# Altium project SC_Flight_Controller.PrjPcb
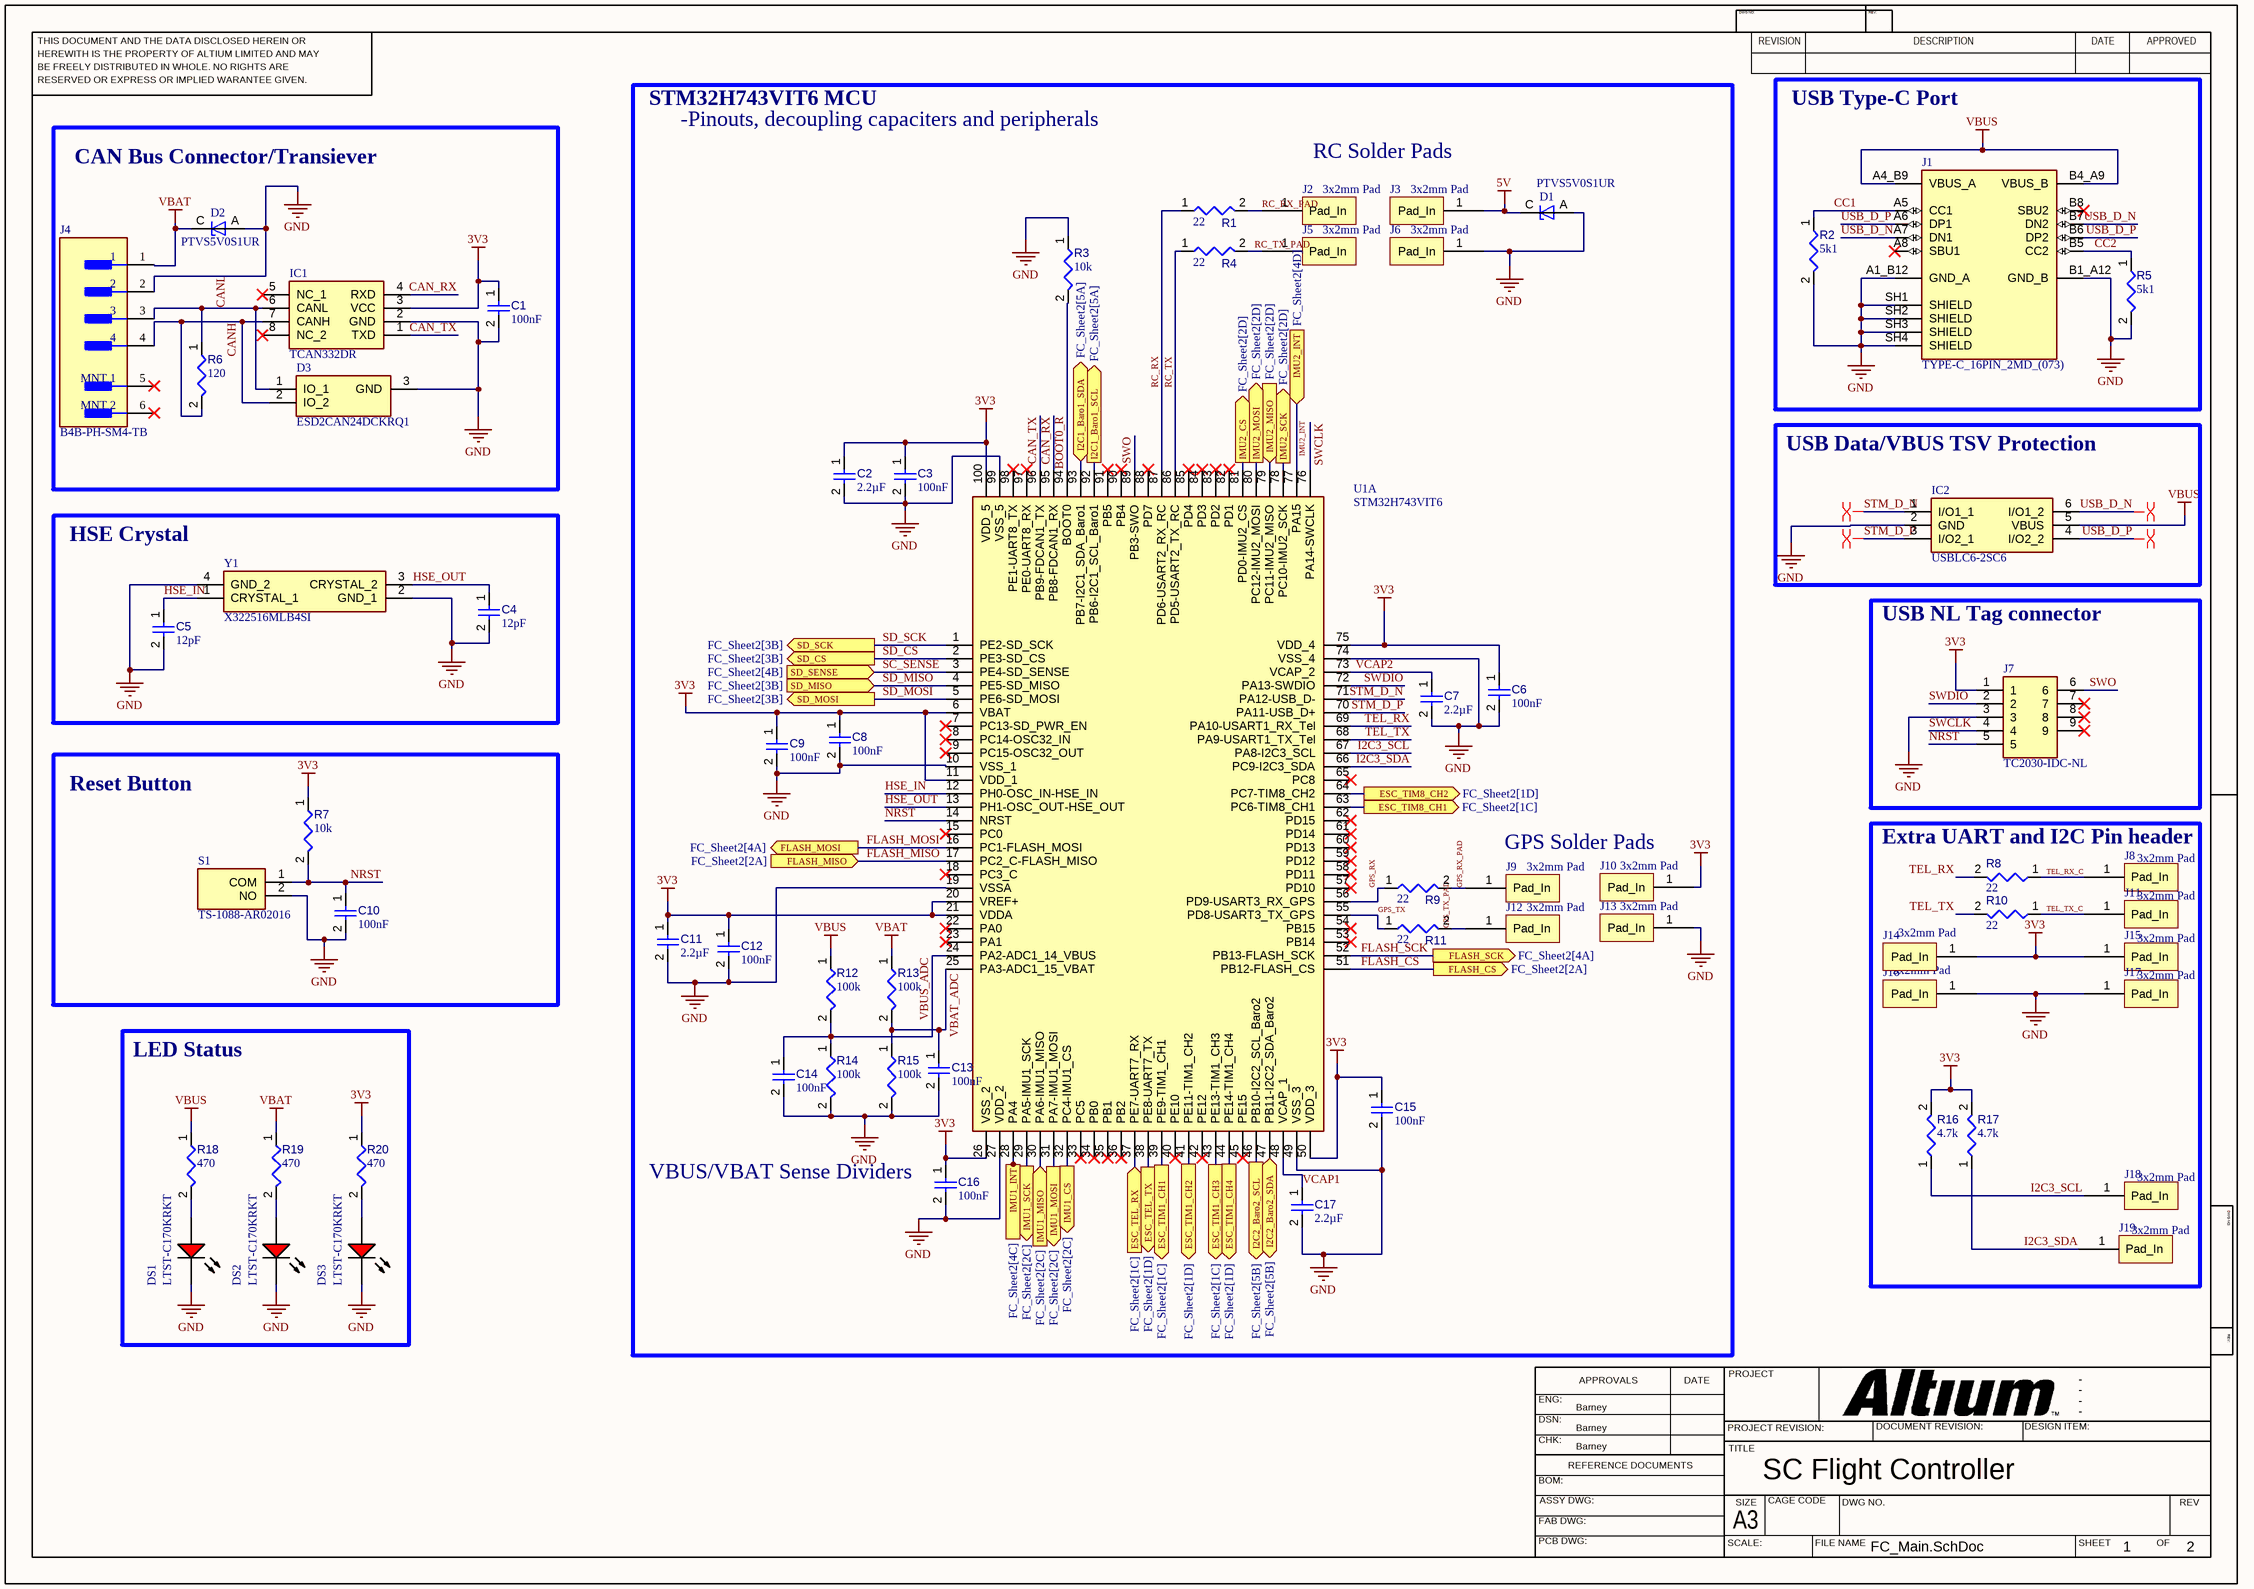
[diagram p0: FC_Main.SchDoc]
2 sheets, 137 parts. Net scope: flat (ports and power ports of the same name join across sheets).
Board file: FC_PCB.PcbDoc
Sheets:
  FC_Main.SchDoc
  FC_Sheet2.SchDoc

## Sheet FC_Main.SchDoc: SC Flight Controller
size 420 x 297 mm; Date: 07/02/2026; ApprovedBy: Barney; CheckedBy: Barney; Author: Barney; CompanyName: -; DrawnBy: Barney; Engineer: Barney; Organization: N/A; Address1: -; Address2: -; Address3: -; Address4: -; DocumentNumber: 1; Revision: 1; SheetNumber: 1; SheetTotal: 2; Time: 12:42

### Parts
C1  value 100nF  [CAPC0402(1005)60_L]  (hidden comment: Capacitor 100nF +/-20% 10V 0402)
C2  value 2.2µF  [CAPC0402(1005)60_L]  (hidden comment: Capacitor 2,2µF +/-20% 10V 0402)
C3  value 100nF  [CAPC0402(1005)60_L]  (hidden comment: Capacitor 100nF +/-20% 10V 0402)
C4  value 12pF  [CAPC0402(1005)33_L]  (hidden comment: Capacitor 12pF +/-10% 50V 0402)
C5  value 12pF  [CAPC0402(1005)33_L]  (hidden comment: Capacitor 12pF +/-10% 50V 0402)
C6  value 100nF  [CAPC0402(1005)60_L]  (hidden comment: Capacitor 100nF +/-20% 10V 0402)
C7  value 2.2µF  [CAPC0402(1005)60_L]  (hidden comment: Capacitor 2,2µF +/-20% 10V 0402)
C8  value 100nF  [CAPC0402(1005)60_L]  (hidden comment: Capacitor 100nF +/-20% 10V 0402)
C9  value 100nF  [CAPC0402(1005)60_L]  (hidden comment: Capacitor 100nF +/-20% 10V 0402)
C10  value 100nF  [CAPC0402(1005)60_L]  (hidden comment: Capacitor 100nF +/-20% 10V 0402)
C11  value 2.2µF  [CAPC0402(1005)60_L]  (hidden comment: Capacitor 2,2µF +/-20% 10V 0402)
C12  value 100nF  [CAPC0402(1005)60_L]  (hidden comment: Capacitor 100nF +/-20% 10V 0402)
C13  value 100nF  [CAPC0402(1005)60_L]  (hidden comment: Capacitor 100nF +/-20% 10V 0402)
C14  value 100nF  [CAPC0402(1005)60_L]  (hidden comment: Capacitor 100nF +/-20% 10V 0402)
C15  value 100nF  [CAPC0402(1005)60_L]  (hidden comment: Capacitor 100nF +/-20% 10V 0402)
C16  value 100nF  [CAPC0402(1005)60_L]  (hidden comment: Capacitor 100nF +/-20% 10V 0402)
C17  value 2.2µF  [CAPC0402(1005)60_L]  (hidden comment: Capacitor 2,2µF +/-20% 10V 0402)
D1  PTVS5V0S1UR  [TVS_PTVS5V0S1UR]
D2  PTVS5V0S1UR  [TVS_PTVS5V0S1UR]
D3  ESD2CAN24DCKRQ1  [SOT65P210X110-3N]
DS1  LTST-C170KRKT  [LTST-C170KRKT_V]
DS2  LTST-C170KRKT  [LTST-C170KRKT_V]
DS3  LTST-C170KRKT  [LTST-C170KRKT_V]
IC1  TCAN332DR  [SOIC127P600X175-8N]
IC2  USBLC6-2SC6  [SOT95P280X145-6N]
J1  TYPE-C_16PIN_2MD_(073)  [SHOUHAN_TYPE-C_16PIN_2MD_(073)]
J2  3x2mm Pad  [3x2mm Pad-Footprint-1]
J3  3x2mm Pad  [3x2mm Pad-Footprint-1]
J4  B4B-PH-SM4-TB  [FP-B4B-PH-SM4-TB-MFG]
J5  3x2mm Pad  [3x2mm Pad-Footprint-1]
J6  3x2mm Pad  [3x2mm Pad-Footprint-1]
J7  TC2030-IDC-NL  [TC2030IDCNL]
J8  3x2mm Pad  [3x2mm Pad-Footprint-1]
J9  3x2mm Pad  [3x2mm Pad-Footprint-1]
J10  3x2mm Pad  [3x2mm Pad-Footprint-1]
J11  3x2mm Pad  [3x2mm Pad-Footprint-1]
J12  3x2mm Pad  [3x2mm Pad-Footprint-1]
J13  3x2mm Pad  [3x2mm Pad-Footprint-1]
J14  3x2mm Pad  [3x2mm Pad-Footprint-1]
J15  3x2mm Pad  [3x2mm Pad-Footprint-1]
J16  3x2mm Pad  [3x2mm Pad-Footprint-1]
J17  3x2mm Pad  [3x2mm Pad-Footprint-1]
J18  3x2mm Pad  [3x2mm Pad-Footprint-1]
J19  3x2mm Pad  [3x2mm Pad-Footprint-1]
R1  value 22  [RESC0402(1005)_L]  (hidden comment: Resistor 22 +/-1 % 0402 63 mW)
R2  value 5k1  [RESC0402(1005)_L]  (hidden comment: Resistor 5K1 +/-1 % 0402 63 mW)
R3  value 10k  [RESC0402(1005)_L]  (hidden comment: Resistor 10K  +/-1 % 0402 63 mW)
R4  value 22  [RESC0402(1005)_L]  (hidden comment: Resistor 22 +/-1 % 0402 63 mW)
R5  value 5k1  [RESC0402(1005)_L]  (hidden comment: Resistor 5K1 +/-1 % 0402 63 mW)
R6  value 120  [RESC0402(1005)_L]  (hidden comment: Resistor 120 +/-1 % 0402 63 mW)
R7  value 10k  [RESC0402(1005)_L]  (hidden comment: Resistor 10K  +/-1 % 0402 63 mW)
R8  value 22  [RESC0402(1005)_L]  (hidden comment: Resistor 22 +/-1 % 0402 63 mW)
R9  value 22  [RESC0402(1005)_L]  (hidden comment: Resistor 22 +/-1 % 0402 63 mW)
R10  value 22  [RESC0402(1005)_L]  (hidden comment: Resistor 22 +/-1 % 0402 63 mW)
R11  value 22  [RESC0402(1005)_L]  (hidden comment: Resistor 22 +/-1 % 0402 63 mW)
R12  value 100k  [RESC0402(1005)_L]  (hidden comment: Resistor 100K +/-1 % 0402 63 mW)
R13  value 100k  [RESC0402(1005)_L]  (hidden comment: Resistor 100K +/-1 % 0402 63 mW)
R14  value 100k  [RESC0402(1005)_L]  (hidden comment: Resistor 100K +/-1 % 0402 63 mW)
R15  value 100k  [RESC0402(1005)_L]  (hidden comment: Resistor 100K +/-1 % 0402 63 mW)
R16  value 4.7k  [RESC0402(1005)_L]  (hidden comment: 4D7KR2F)
R17  value 4.7k  [RESC0402(1005)_L]  (hidden comment: 4D7KR2F)
R18  value 470  [RESC0805(2012)_L]  (hidden comment: Resistor 470R +/-5% 0805 125 mW)
R19  value 470  [RESC0805(2012)_L]  (hidden comment: Resistor 470R +/-5% 0805 125 mW)
R20  value 470  [RESC0805(2012)_L]  (hidden comment: Resistor 470R +/-5% 0805 125 mW)
S1  TS-1088-AR02016  [TS1088AR02016]
U1  STM32H743VIT6  [QFP50P1600X1600X160-100N]  (part A of 3)
Y1  X322516MLB4SI  [X322516MLB4SI]

### Blocks framed on the sheet
USB Type-C Port: J1 R2 R5
CAN Bus Connector/Transiever: C1 D2 D3 IC1 J4 R6
USB Data/VBUS TSV Protection: IC2
HSE Crystal: C4 C5 Y1
USB NL Tag connector: J7
Reset Button: C10 R7 S1
Extra UART and I2C Pin header: J8 J11 J14-J19 R8 R10 R16 R17
LED Status: DS1-DS3 R18-R20

### Ports
ESC_TEL_RX (in, see FC_Sheet2[1C]), ESC_TEL_TX (out, see FC_Sheet2[1D]), ESC_TIM1_CH1 (out, see FC_Sheet2[1C]), ESC_TIM1_CH2 (out, see FC_Sheet2[1D]), ESC_TIM1_CH3 (out, see FC_Sheet2[1C]), ESC_TIM1_CH4 (out, see FC_Sheet2[1D]), ESC_TIM8_CH1 (out, see FC_Sheet2[1C]), ESC_TIM8_CH2 (out, see FC_Sheet2[1D]), FLASH_CS (out, see FC_Sheet2[2A]), FLASH_MISO (in, see FC_Sheet2[2A]), FLASH_MOSI (out, see FC_Sheet2[4A]), FLASH_SCK (out, see FC_Sheet2[4A]), I2C1_Baro1_SCL (out, see FC_Sheet2[5A]), I2C1_Baro1_SDA (bidir, see FC_Sheet2[5A]), I2C2_Baro2_SCL (out, see FC_Sheet2[5B]), I2C2_Baro2_SDA (bidir, see FC_Sheet2[5B]), IMU1_CS (out, see FC_Sheet2[2C]), IMU1_INT (in, see FC_Sheet2[4C]), IMU1_MISO (in, see FC_Sheet2[2C]), IMU1_MOSI (out, see FC_Sheet2[2C]), IMU1_SCK (out, see FC_Sheet2[2C]), IMU2_CS (out, see FC_Sheet2[2D]), IMU2_INT (in, see FC_Sheet2[4D]), IMU2_MISO (in, see FC_Sheet2[2D]), IMU2_MOSI (out, see FC_Sheet2[2D]), IMU2_SCK (out, see FC_Sheet2[2D]), SD_CS (out, see FC_Sheet2[3B]), SD_MISO (in, see FC_Sheet2[3B]), SD_MOSI (out, see FC_Sheet2[3B]), SD_SCK (out, see FC_Sheet2[3B]), SD_SENSE (in, see FC_Sheet2[4B])

### Nets
3V3: C1.1 C2.1 C3.1 C6.1 C8.1 C9.1 C11.1 C12.1 C15.1 C16.1 IC1.3(VCC) J7.1 J10.1(Pad_In) J14.1(Pad_In) J15.1(Pad_In) R7.1 R16.2 R17.2 R20.1 U1.6(VBAT) U1.11(VDD_1) U1.20(VREF+) U1.21(VDDA) U1.26(VSS_2) U1.50(VDD_3) U1.75(VDD_4) U1.100(VDD_5)
5V: D1.C J3.1(Pad_In)
GND: C1.2 C2.2 C3.2 C4.2 C5.2 C6.2 C7.2 C8.2 C9.2 C10.2 C11.2 C12.2 C13.2 C14.2 C15.2 C16.2 C17.2 D1.A D2.A D3.3(GND) DS1.2(K) DS2.2(K) DS3.2(K) IC1.2(GND) IC2.2(GND) J1.A1_B12(GND_A) J1.B1_A12(GND_B) J1.SH1(SHIELD) J1.SH2(SHIELD) J1.SH3(SHIELD) J1.SH4(SHIELD) J4.2 J6.1(Pad_In) J7.3 J13.1(Pad_In) J16.1(Pad_In) J17.1(Pad_In) R2.2 R3.1 R5.2 R14.2 R15.2 S1.2(NO) U1.10(VSS_1) U1.19(VSSA) U1.27(VDD_2) U1.49(VSS_3) U1.74(VSS_4) U1.99(VSS_5) Y1.2(GND_1) Y1.4(GND_2)
VBAT: D2.C J4.1 R13.1 R19.1
VBUS: IC2.5(VBUS) J1.A4_B9(VBUS_A) J1.B4_A9(VBUS_B) R12.1 R18.1
Baro1_SCL: U1.92(PB6-I2C1_SCL_Baro1) ; port I2C1_Baro1_SCL
Baro1_SDA: U1.93(PB7-I2C1_SDA_Baro1) ; port I2C1_Baro1_SDA
Baro2_SCL: U1.46(PB10-I2C2_SCL_Baro2) ; port I2C2_Baro2_SCL
Baro2_SDA: U1.47(PB11-I2C2_SDA_Baro2) ; port I2C2_Baro2_SDA
BOOT0_R: R3.2 U1.94(BOOT0)
CAN_RX: IC1.4(RXD) U1.95(PB8-FDCAN1_RX)
CAN_TX: IC1.1(TXD) U1.96(PB9-FDCAN1_TX)
CANH: D3.2(IO_2) IC1.7(CANH) J4.4 R6.2
CANL: D3.1(IO_1) IC1.6(CANL) J4.3 R6.1
CC1: J1.A5(CC1) R2.1
CC2: J1.B5(CC2) R5.1
ESC_TEL_RX: U1.37(PE7-UART7_RX) ; port ESC_TEL_RX
ESC_TEL_TX: U1.38(PE8-UART7_TX) ; port ESC_TEL_TX
FLASH_CS: U1.51(PB12-FLASH_CS) ; port FLASH_CS
FLASH_MISO: U1.17(PC2_C-FLASH_MISO) ; port FLASH_MISO
FLASH_MOSI: U1.16(PC1-FLASH_MOSI) ; port FLASH_MOSI
FLASH_SCK: U1.52(PB13-FLASH_SCK) ; port FLASH_SCK
GPS_RX: R9.1 U1.56(PD9-USART3_RX_GPS)
GPS_RX_PAD: J9.1(Pad_In) R9.2
GPS_TX: R11.1 U1.55(PD8-USART3_TX_GPS)
GPS_TX_PAD: J12.1(Pad_In) R11.2
HSE_IN: C5.1 U1.12(PH0-OSC_IN-HSE_IN) Y1.1(CRYSTAL_1)
HSE_OUT: C4.1 U1.13(PH1-OSC_OUT-HSE_OUT) Y1.3(CRYSTAL_2)
I2C3_SCL: J18.1(Pad_In) R16.1 U1.67(PA8-I2C3_SCL)
I2C3_SDA: J19.1(Pad_In) R17.1 U1.66(PC9-I2C3_SDA)
IMU1_CS: U1.32(PC4-IMU1_CS) ; port IMU1_CS
IMU1_INT: U1.28(PA4) ; port IMU1_INT
IMU1_MISO: U1.30(PA6-IMU1_MISO) ; port IMU1_MISO
IMU1_MOSI: U1.31(PA7-IMU1_MOSI) ; port IMU1_MOSI
IMU1_SCK: U1.29(PA5-IMU1_SCK) ; port IMU1_SCK
IMU2_CS: U1.81(PD0-IMU2_CS) ; port IMU2_CS
IMU2_INT: U1.77(PA15) ; port IMU2_INT
IMU2_MISO: U1.79(PC11-IMU2_MISO) ; port IMU2_MISO
IMU2_MOSI: U1.80(PC12-IMU2_MOSI) ; port IMU2_MOSI
IMU2_SCK: U1.78(PC10-IMU2_SCK) ; port IMU2_SCK
NRST: C10.1 J7.5 R7.2 S1.1(COM) U1.14(NRST)
RC_RX: R1.1 U1.87(PD6-USART2_RX_RC)
RC_RX_PAD: J2.1(Pad_In) R1.2
RC_TX: R4.1 U1.86(PD5-USART2_TX_RC)
RC_TX_PAD: J5.1(Pad_In) R4.2
SC_SENSE: U1.3(PE4-SD_SENSE) ; port SD_SENSE
SD_CS: U1.2(PE3-SD_CS) ; port SD_CS
SD_MISO: U1.4(PE5-SD_MISO) ; port SD_MISO
SD_MOSI: U1.5(PE6-SD_MOSI) ; port SD_MOSI
SD_SCK: U1.1(PE2-SD_SCK) ; port SD_SCK
STM_D_N: IC2.1(I/O1_1) U1.71(PA12-USB_D-)
STM_D_P: IC2.3(I/O2_1) U1.70(PA11-USB_D+)
SWCLK: J7.4 U1.76(PA14-SWCLK)
SWDIO: J7.2 U1.72(PA13-SWDIO)
SWO: J7.6 U1.89(PB3-SWO)
T1-1: U1.39(PE9-TIM1_CH1) ; port ESC_TIM1_CH1
T1-2: U1.41(PE11-TIM1_CH2) ; port ESC_TIM1_CH2
T1-3: U1.43(PE13-TIM1_CH3) ; port ESC_TIM1_CH3
T1-4: U1.44(PE14-TIM1_CH4) ; port ESC_TIM1_CH4
T8-1: U1.63(PC6-TIM8_CH1) ; port ESC_TIM8_CH1
T8-2: U1.64(PC7-TIM8_CH2) ; port ESC_TIM8_CH2
TEL_RX: R8.2 U1.69(PA10-USART1_RX_Tel)
TEL_RX_C: J8.1(Pad_In) R8.1
TEL_TX: R10.2 U1.68(PA9-USART1_TX_Tel)
TEL_TX_C: J11.1(Pad_In) R10.1
USB_D_N: IC2.6(I/O1_2) J1.A7(DN1) J1.B7(DN2)
USB_D_P: IC2.4(I/O2_2) J1.A6(DP1) J1.B6(DP2)
VBAT_ADC: C13.1 R13.2 R15.1 U1.25(PA3-ADC1_15_VBAT)
VBUS_ADC: C14.1 R12.2 R14.1 U1.24(PA2-ADC1_14_VBUS)
VCAP1: C17.1 U1.48(VCAP_1)
VCAP2: C7.1 U1.73(VCAP_2)
NetDS1_1: DS1.1(A) R18.2
NetDS2_1: DS2.1(A) R19.2
NetDS3_1: DS3.1(A) R20.2

Not connected (* = marked no-connect by the designer): IC1 5(NC_1)* 8(NC_2)*; J1 A8(SBU1)* B8(SBU2)*; J4 5(MNT_1)* 6(MNT_2)*; J7 7* 8* 9*; U1 7(PC13-SD_PWR_EN)* 8(PC14-OSC32_IN)* 9(PC15-OSC32_OUT)* 15(PC0)* 18(PC3_C)* 22(PA0)* 23(PA1)* 33(PC5)* 34(PB0)* 35(PB1)* 36(PB2)* 40(PE10)* 42(PE12)* 45(PE15)* 53(PB14)* 54(PB15)* 57(PD10)* 58(PD11)* 59(PD12)* 60(PD13)* 61(PD14)* 62(PD15)* 65(PC8)* 82(PD1)* 83(PD2)* 84(PD3)* 85(PD4)* 88(PD7)* 90(PB4)* 91(PB5)* 97(PE0-UART8_RX)* 98(PE1-UART8_TX)*

### Layout directives
differential pair: STM_D_N, STM_D_P, USB_D_N, USB_D_P

### Notes on the sheet
- STM32H743VIT6 MCU
- -Pinouts, decoupling capaciters and peripherals
- RC Solder Pads
- GPS Solder Pads
- (near C16) VBUS/VBAT Sense Dividers
- THIS DOCUMENT AND THE DATA DISCLOSED HEREIN OR
- HEREWITH IS THE PROPERTY OF ALTIUM LIMITED AND MAY
- DWG NO:
- REVISION
- REV:
- DESCRIPTION
- DATE
- APPROVED
- BE FREELY DISTRIBUTED IN WHOLE. NO RIGHTS ARE
- RESERVED OR EXPRESS OR IMPLIED WARANTEE GIVEN.
- ENG:
- APPROVALS
- PROJECT
- DSN:
- CHK:
- REFERENCE DOCUMENTS
- PROJECT REVISION:
- TITLE
- DOCUMENT REVISION:
- DESIGN ITEM:
- BOM:
- FAB DWG:
- PCB DWG:
- ASSY DWG:
- SCALE:
- A3
- SIZE
- CAGE CODE
- FILE NAME
- DWG NO.
- SHEET
- OF
- REV

### Library data of the parts
C1 C3 C6 C8-C10 C12-C16 = CMP-001-00061-3: Chip Capacitor, 100nF +/-20%, 10V, 0402, Thickness 0.6 mm; Tolerance: 20%; Mounting Technology: SMT; Voltage Rating: 10V; Max Operating Temperature: 85°C; Pins: 2; Case/Package: 0402; Min Operating Temperature: -55°C
C2 C7 C11 C17 = CMP-001-00056-4: Chip Capacitor, 2,2µF +/-20%, 10V, 0402, Thickness 0.6 mm; Tolerance: 10%; Mounting Technology: SMT; Max Operating Temperature: 85°C; Case/Package: 0402; Pins: 2; Min Operating Temperature: -55°C; Voltage Rating: 10V
C4 C5 = CMP-001-00072-4: Chip Capacitor, 12pF +/-10%, 50V, 0402, Thickness 0.33 mm; Tolerance: 20%; Pins: 2; Max Operating Temperature: 85°C; Case/Package: 0402; Voltage Rating: 50V; Mounting Technology: SMT; Min Operating Temperature: -55°C
D1 D2 = CMP-004-00031-1: 9.2V Clamp 43.5A Ipp Tvs Diode Surface Mount SOD-123W; MF: Nexperia USA; SnapEDA_Link: https://www.snapeda.com/parts/PTVS5V0S1UR/Nexperia/view-part/?ref=snap; Check_prices: https://www.snapeda.com/parts/PTVS5V0S1UR/Nexperia/view-part/?ref=eda; Design Item ID: PTVS5V0S1UR; Availability: In Stock; Value: *; Case/Package: SOD-123 Nexperia USA; Pins: 2; Price: None; Source: PTVS5V0S1UR.SchLib; Component Type: Standard; MP: PTVS5V0S1UR; Purchase-URL: https://pricing.snapeda.com/search/part/PTVS5V0S1UR/?ref=eda
D3 = ESD2CAN24DCKRQ1: TVS Diode (Bi-directional); Manufacturer_Name: Texas Instruments; Datasheet Link: https://www.ti.com/lit/ds/symlink/esd2can24-q1.pdf?ts=1669637432096&ref_url=https%253A%252F%252Fwww.ti.com%252Fproduct%252FESD2CAN24-Q1; Height: 1.1mm; Manufacturer_Part_Number: ESD2CAN24DCKRQ1; Mouser Part Number: 595-ESD2CAN24DCKRQ1; Mouser Price/Stock: https://www.mouser.co.uk/ProductDetail/Texas-Instruments/ESD2CAN24DCKRQ1?qs=Y0Uzf4wQF3mF7ctB4rszMA%3D%3D; Arrow Part Number: ESD2CAN24DCKRQ1; Arrow Price/Stock: https://www.arrow.com/en/products/esd2can24dckrq1/texas-instruments?utm_currency=USD&region=nac
DS1-DS3 = CMP-2000-07593-1: LED Red, 75 mW, 54 mcd, -55 to 85 degC, 2-Pin SMD, RoHS, Tape and Reel; Manufacturer: Lite-On; Lens Transparency: Clear; Number of Elements: 1; Power Rating: 75mW; Luminous Intensity: 54mcd; Viewing Angle: 130degrees; Forward Current: 30mA; Wavelength: 639nm; Lens Style: Rectangular; Case\/Package: 0805; Test Current: 20mA; Dominant Wavelength: 631nm; Forward Voltage: 2V; Lens Colour: Colorless; Min Operating Temperature: -55degC; RoHSCompliant: True; Length: 3.2mm; Width: 1.25mm; Mount: SurfaceMount; Packaging: TapeandReel; Number of LEDs: 1; Radiation Hardening: No; Datasheet URL: http://optoelectronics.liteon.com/upload/download/DS-22-99-0150/LTST-C170KRKT.pdf; Datasheet Version: Rev. D, 11/2014; Case Code (Metric): 2012; Height: 1.1mm; Number of Pins: 2; Package Description: 2-Pin Surface Mount Device, Body 2 x 1.25 mm; Manufacturer URL: http://www.us.liteon.com/; Lead Free: LeadFree; Illumination Colour: Red; Colour: Red; Case Code (Imperial): 0805; Max Operating Temperature: 85degC; Power Dissipation: 75mW; Mounting Technology: SurfaceMount; Package Reference: C170KRKT; Package Quantity: 1; Depth: 1.6mm
IC1 = TCAN332DR: Integrated Circuit; Manufacturer_Name: Texas Instruments; Datasheet Link: http://www.ti.com/lit/ds/symlink/tcan332.pdf; Height: 1.75mm; Manufacturer_Part_Number: TCAN332DR; Mouser Part Number: 595-TCAN332DR; Mouser Price/Stock: https://www.mouser.co.uk/ProductDetail/Texas-Instruments/TCAN332DR?qs=n%252BTO0c4TDSYIUeM9WmVMtA%3D%3D; Arrow Part Number: TCAN332DR; Arrow Price/Stock: https://www.arrow.com/en/products/tcan332dr/texas-instruments?utm_currency=USD&region=nac
IC2 = USBLC6-2SC6: Integrated Circuit; Manufacturer_Name: STMicroelectronics; Datasheet Link: https://www.st.com/resource/en/datasheet/usblc6-2.pdf; Height: 1.45mm; Manufacturer_Part_Number: USBLC6-2SC6; Mouser Part Number: 511-USBLC6-2SC6; Mouser Price/Stock: https://www.mouser.co.uk/ProductDetail/STMicroelectronics/USBLC6-2SC6?qs=po45yt2pPpu%2FhNIlwQdTlg%3D%3D; Arrow Part Number: USBLC6-2SC6; Arrow Price/Stock: https://www.arrow.com/en/products/usblc6-2sc6/stmicroelectronics?utm_currency=USD&region=europe
J1 = CMP-025-000000-1: DC-5V 5A Type C USB; MP: TYPE-C 16PIN 2MD (073); MF: Shouhan; Source: TYPE-C_16PIN_2MD_(073).SchLib; Component Type: Standard; Check_prices: https://www.snapeda.com/parts/TYPE-C%2016PIN%202MD%20(073)/Shouhan/view-part/?ref=eda; Design Item ID: TYPE-C_16PIN_2MD_(073); Value: *; SnapEDA_Link: https://www.snapeda.com/parts/TYPE-C%2016PIN%202MD%20(073)/Shouhan/view-part/?ref=snap; Pin Count: 16; Package: Package
J2 J3 J5 J6 J8-J19 = CMP-002-00076-3: 3mm x 2mm Pad to solder
J4 = CMP-17439-000131-1: CONN HEADER SMD 4POS 2MM; Orientation: Vertical
J7 = TC2030-IDC-NL: Connector; Manufacturer_Name: Tag Connect; Height: 18.669mm; Manufacturer_Part_Number: TC2030-IDC-NL
R1 R4 R8-R11 = CMP-009-00168-3: Chip Resistor, 22Ohms, +/-1 %, 63 mW, -55 to 155 degC, 0402; Tolerance: 1%; Power: 63mW; Max Operating Temperature: 155°C; Min Operating Temperature: -55°C; Pins: 2; Case/Package: 0402
R2 R5 = CMP-009-00168-3: Chip Resistor, 5.1 kOhms, +/-1 %, 63 mW, -55 to 155 degC, 0402; Tolerance: 1%; Power: 63mW; Max Operating Temperature: 155°C; Min Operating Temperature: -55°C; Pins: 2; Case/Package: 0402
R3 R7 = CMP-009-00149-3: Chip Resistor, 10 kOhms, +/-1 %, 63 mW, -55 to 125 degC, 0402; Power: 63mW; Tolerance: 1%; Min Operating Temperature: -55°C; Case/Package: 0402; Max Operating Temperature: 155°C; Pins: 2
R6 = CMP-009-00168-3: Chip Resistor, 120 Ohms, +/-1 %, 63 mW, -55 to 155 degC, 0402; Tolerance: 1%; Power: 63mW; Max Operating Temperature: 155°C; Min Operating Temperature: -55°C; Pins: 2; Case/Package: 0402
R12-R15 = CMP-009-00168-3: Chip Resistor, 100 kOhms, +/-1 %, 63 mW, -55 to 155 degC, 0402; Tolerance: 1%; Power: 63mW; Max Operating Temperature: 155°C; Min Operating Temperature: -55°C; Pins: 2; Case/Package: 0402
R16 R17 = CMP-009-00105-2: 4K7 0.063W 1% 0402 (1005 Metric)  SMD; Power: 63mW; Mounting Technology: SMT; Case/Package: 0402; Tolerance: 1%; Pins: 2
R18-R20 = CMP-009-00122-3: Chip Resistor, 470 Ohms, +/-5%, 125 mW, -55 to 155 degC, 0805; Tolerance: 5%; Power: 125mW; Max Operating Temperature: 155°C; Case/Package: 0805; Pins: 2; Min Operating Temperature: -55°C
S1 = TS-1088-AR02016: Switch; Manufacturer_Name: XUNPU; Datasheet Link: https://www.xunpudianzi.com/uploads/pdf/TS-1088-ARXXX.pdf; Height: 2mm; Manufacturer_Part_Number: TS-1088-AR02016
U1 = CMP-031-00006-1: ARM Microcontrollers - MCU High-performance and DSP with DP-FPU, ARM Cortex-M7 MCU with 2MBytes Flash, 1MB RAM, 400 MHz CPU, Art Accelerator, L1 cache, external memory interface, large set of peripherals; Manufacturer_Name: STMicroelectronics; Geometry.Height: 1.6mm; Datasheet Link: https://www.st.com/resource/en/datasheet/stm32h743vi.pdf; Manufacturer_Part_Number: STM32H743VIT6; Design Item ID: STM32H743VIT6; Source: STM32H743VIT6.SchLib
Y1 = X322516MLB4SI: Crystal or Oscillator; Manufacturer_Name: Yangxing Tech; Datasheet Link: https://datasheet.lcsc.com/szlcsc/Yangxing-Tech-X322516MLB4SI_C13738.pdf; Height: 0.8mm; Manufacturer_Part_Number: X322516MLB4SI

## Sheet FC_Sheet2.SchDoc: SC Flight Controller
size 420 x 297 mm; Date: 07/02/2026; ApprovedBy: Barney; CheckedBy: Barney; Author: Barney; CompanyName: -; DrawnBy: Barney; Engineer: Barney; Organization: -; Address1: -; Address2: -; Address3: -; Address4: -; DocumentNumber: 2; Revision: 1; SheetNumber: 2; SheetTotal: 2; Time: 12:44
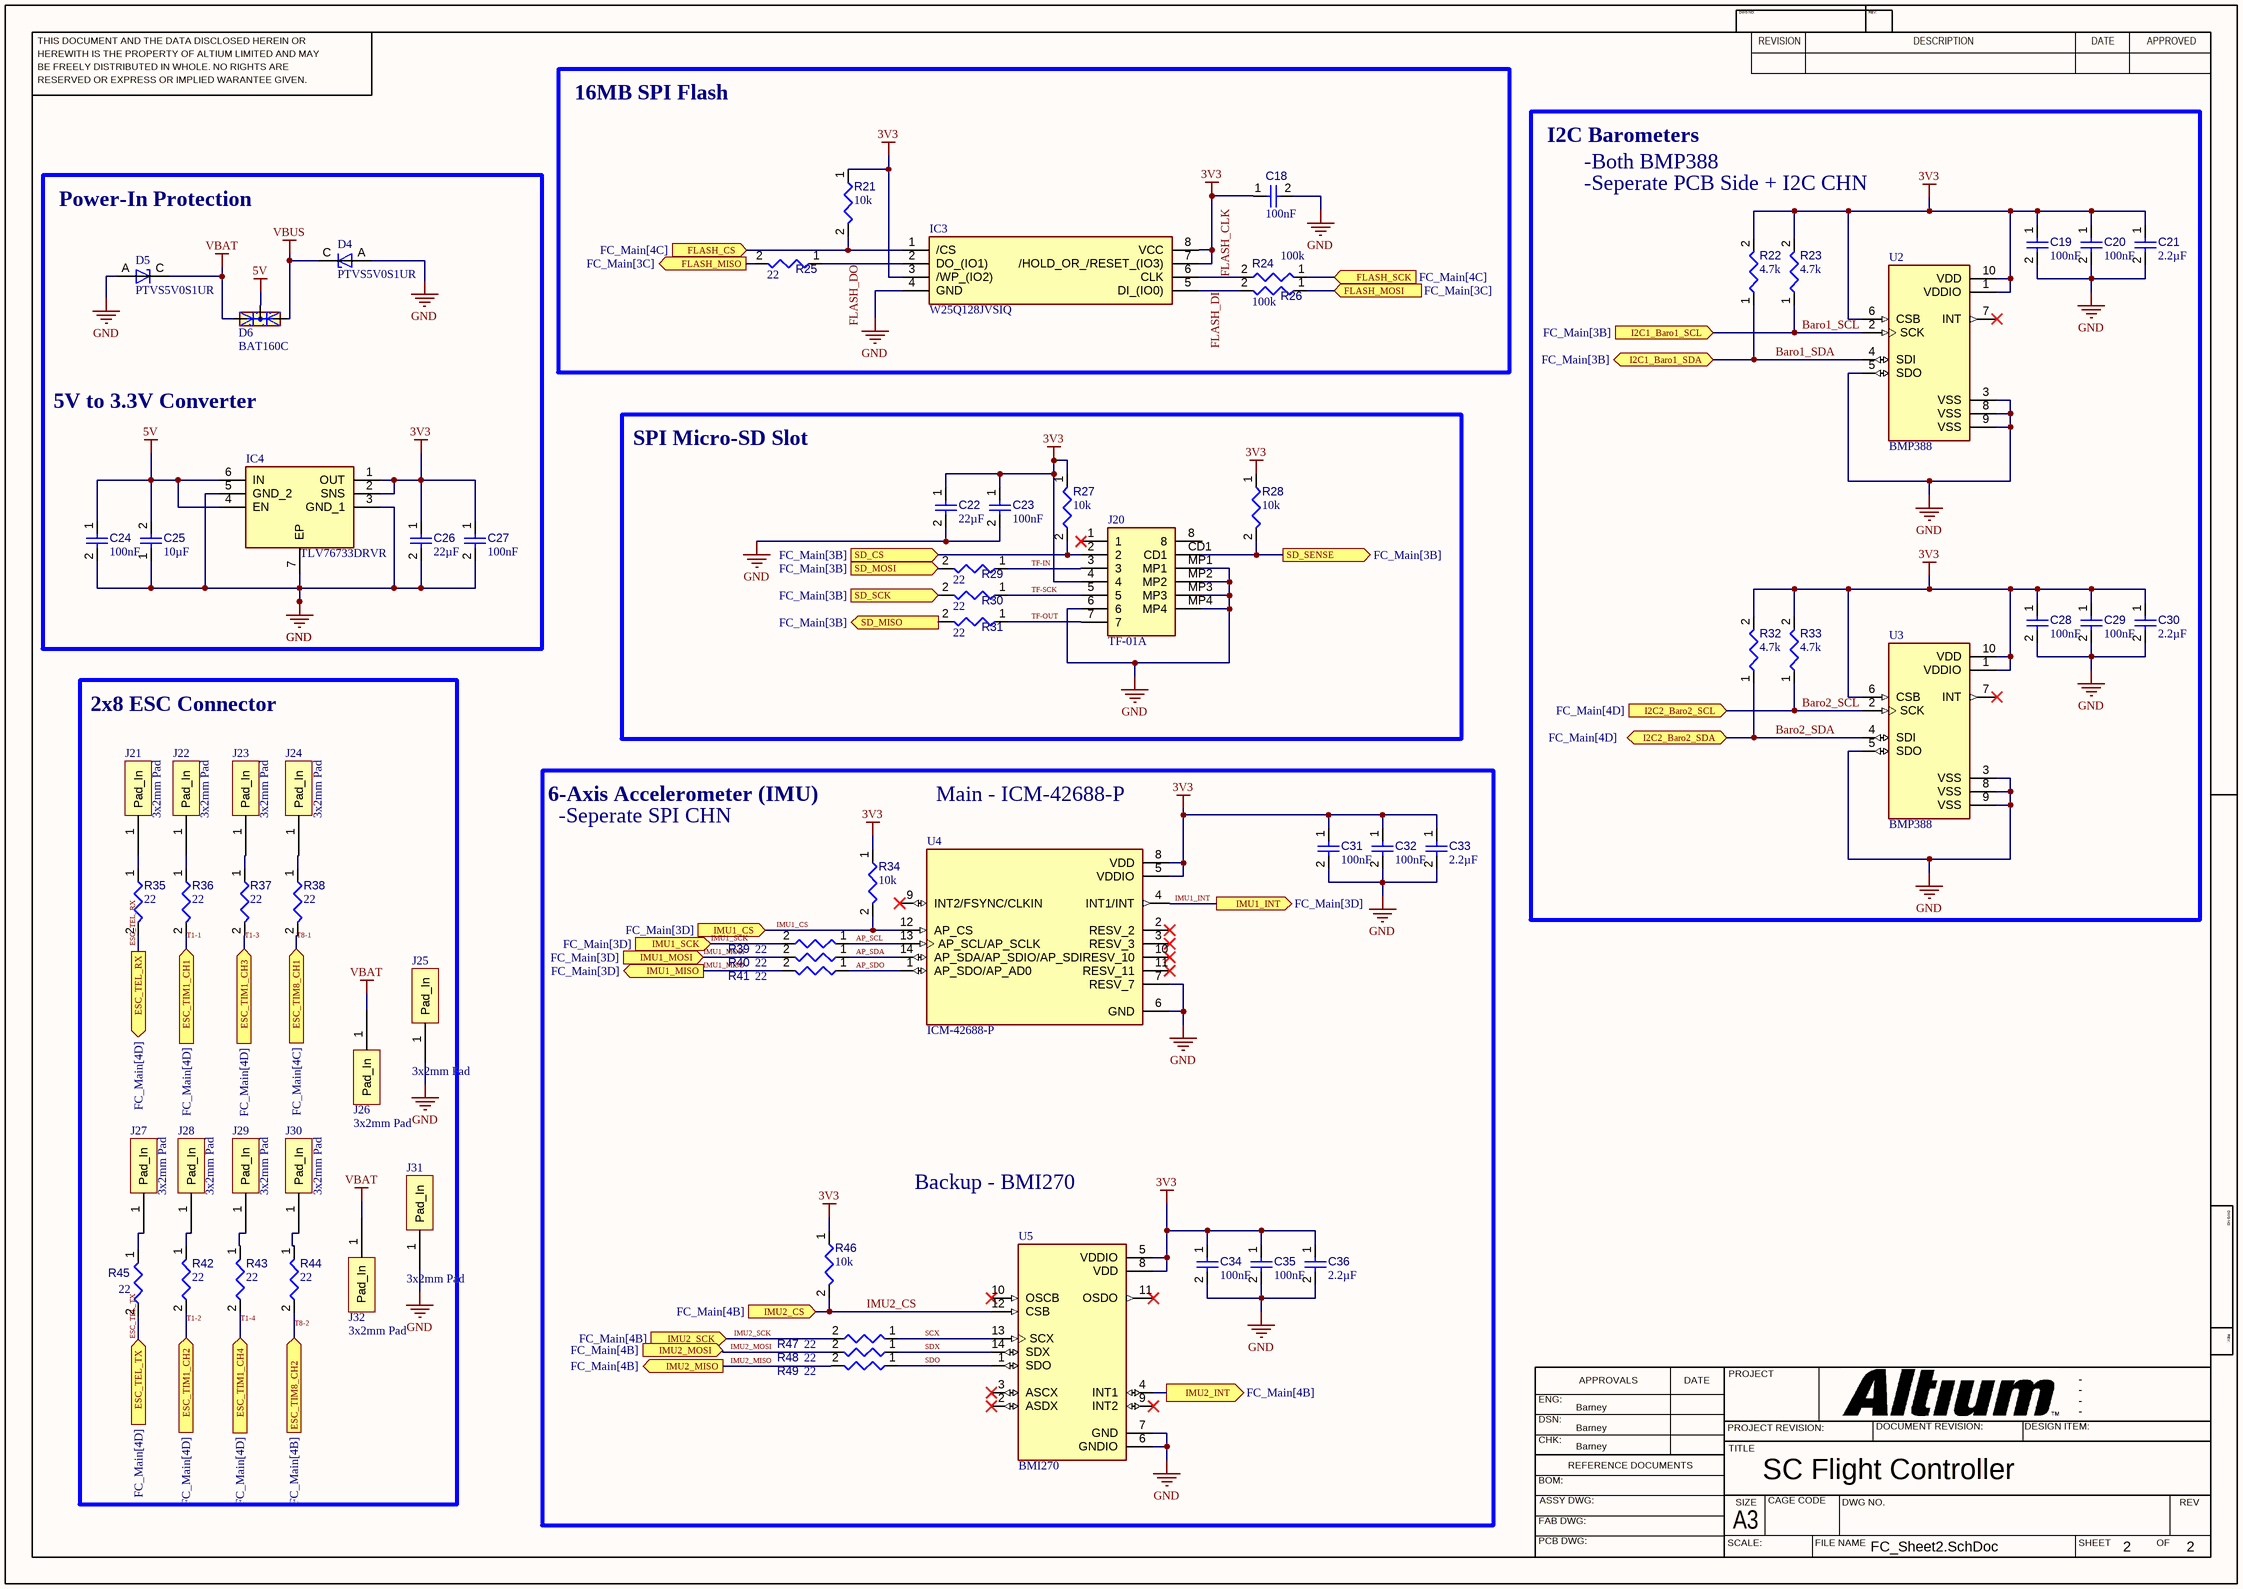
[diagram p1: FC_Sheet2.SchDoc]

### Parts
C18  value 100nF  [CAPC0402(1005)60_L]  (hidden comment: Capacitor 100nF +/-20% 10V 0402)
C19  value 100nF  [CAPC0402(1005)60_L]  (hidden comment: Capacitor 100nF +/-20% 10V 0402)
C20  value 100nF  [CAPC0402(1005)60_L]  (hidden comment: Capacitor 100nF +/-20% 10V 0402)
C21  value 2.2µF  [CAPC0402(1005)60_L]  (hidden comment: Capacitor 2,2µF +/-20% 10V 0402)
C22  value 22µF  [CAPC0805(2012)145_L]  (hidden comment: Capacitor 22µF +/-40% 16V 0805)
C23  value 100nF  [CAPC0402(1005)60_L]  (hidden comment: Capacitor 100nF +/-20% 10V 0402)
C24  value 100nF  [CAPC0402(1005)60_L]  (hidden comment: Capacitor 100nF +/-20% 10V 0402)
C25  value 10µF  [CAPC0603(1608)100_L]  (hidden comment: Capacitor 10µF +/-20% 10V 0603)
C26  value 22µF  [CAPC0805(2012)145_L]  (hidden comment: Capacitor 22µF +/-40% 16V 0805)
C27  value 100nF  [CAPC0402(1005)60_L]  (hidden comment: Capacitor 100nF +/-20% 10V 0402)
C28  value 100nF  [CAPC0402(1005)60_L]  (hidden comment: Capacitor 100nF +/-20% 10V 0402)
C29  value 100nF  [CAPC0402(1005)60_L]  (hidden comment: Capacitor 100nF +/-20% 10V 0402)
C30  value 2.2µF  [CAPC0402(1005)60_L]  (hidden comment: Capacitor 2,2µF +/-20% 10V 0402)
C31  value 100nF  [CAPC0402(1005)60_L]  (hidden comment: Capacitor 100nF +/-20% 10V 0402)
C32  value 100nF  [CAPC0402(1005)60_L]  (hidden comment: Capacitor 100nF +/-20% 10V 0402)
C33  value 2.2µF  [CAPC0402(1005)60_L]  (hidden comment: Capacitor 2,2µF +/-20% 10V 0402)
C34  value 100nF  [CAPC0402(1005)60_L]  (hidden comment: Capacitor 100nF +/-20% 10V 0402)
C35  value 100nF  [CAPC0402(1005)60_L]  (hidden comment: Capacitor 100nF +/-20% 10V 0402)
C36  value 2.2µF  [CAPC0402(1005)60_L]  (hidden comment: Capacitor 2,2µF +/-20% 10V 0402)
D4  PTVS5V0S1UR  [TVS_PTVS5V0S1UR]
D5  PTVS5V0S1UR  [TVS_PTVS5V0S1UR]
D6  BAT160C  [SOT223]
IC3  W25Q128JVSIQ  [SOIC127P790X216-8N]
IC4  TLV76733DRVR  [SON65P200X200X80-7N]
J20  TF-01A  [TF01A]
J21  3x2mm Pad  [3x2mm Pad-Footprint-1]
J22  3x2mm Pad  [3x2mm Pad-Footprint-1]
J23  3x2mm Pad  [3x2mm Pad-Footprint-1]
J24  3x2mm Pad  [3x2mm Pad-Footprint-1]
J25  3x2mm Pad  [3x2mm Pad-Footprint-1]
J26  3x2mm Pad  [3x2mm Pad-Footprint-1]
J27  3x2mm Pad  [3x2mm Pad-Footprint-1]
J28  3x2mm Pad  [3x2mm Pad-Footprint-1]
J29  3x2mm Pad  [3x2mm Pad-Footprint-1]
J30  3x2mm Pad  [3x2mm Pad-Footprint-1]
J31  3x2mm Pad  [3x2mm Pad-Footprint-1]
J32  3x2mm Pad  [3x2mm Pad-Footprint-1]
R21  value 10k  [RESC0402(1005)_L]  (hidden comment: Resistor 10K  +/-1 % 0402 63 mW)
R22  value 4.7k  [RESC0402(1005)_L]  (hidden comment: 4D7KR2F)
R23  value 4.7k  [RESC0402(1005)_L]  (hidden comment: 4D7KR2F)
R24  value 100k  [RESC0402(1005)_L]  (hidden comment: Resistor 100K +/-1 % 0402 63 mW)
R25  value 22  [RESC0402(1005)_L]  (hidden comment: Resistor 22 +/-1 % 0402 63 mW)
R26  value 100k  [RESC0402(1005)_L]  (hidden comment: Resistor 100K +/-1 % 0402 63 mW)
R27  value 10k  [RESC0402(1005)_L]  (hidden comment: Resistor 10K  +/-1 % 0402 63 mW)
R28  value 10k  [RESC0402(1005)_L]  (hidden comment: Resistor 10K  +/-1 % 0402 63 mW)
R29  value 22  [RESC0402(1005)_L]  (hidden comment: Resistor 22 +/-1 % 0402 63 mW)
R30  value 22  [RESC0402(1005)_L]  (hidden comment: Resistor 22 +/-1 % 0402 63 mW)
R31  value 22  [RESC0402(1005)_L]  (hidden comment: Resistor 22 +/-1 % 0402 63 mW)
R32  value 4.7k  [RESC0402(1005)_L]  (hidden comment: 4D7KR2F)
R33  value 4.7k  [RESC0402(1005)_L]  (hidden comment: 4D7KR2F)
R34  value 10k  [RESC0402(1005)_L]  (hidden comment: Resistor 10K  +/-1 % 0402 63 mW)
R35  value 22  [RESC0402(1005)_L]  (hidden comment: Resistor 22 +/-1 % 0402 63 mW)
R36  value 22  [RESC0402(1005)_L]  (hidden comment: Resistor 22 +/-1 % 0402 63 mW)
R37  value 22  [RESC0402(1005)_L]  (hidden comment: Resistor 22 +/-1 % 0402 63 mW)
R38  value 22  [RESC0402(1005)_L]  (hidden comment: Resistor 22 +/-1 % 0402 63 mW)
R39  value 22  [RESC0402(1005)_L]  (hidden comment: Resistor 22 +/-1 % 0402 63 mW)
R40  value 22  [RESC0402(1005)_L]  (hidden comment: Resistor 22 +/-1 % 0402 63 mW)
R41  value 22  [RESC0402(1005)_L]  (hidden comment: Resistor 22 +/-1 % 0402 63 mW)
R42  value 22  [RESC0402(1005)_L]  (hidden comment: Resistor 22 +/-1 % 0402 63 mW)
R43  value 22  [RESC0402(1005)_L]  (hidden comment: Resistor 22 +/-1 % 0402 63 mW)
R44  value 22  [RESC0402(1005)_L]  (hidden comment: Resistor 22 +/-1 % 0402 63 mW)
R45  value 22  [RESC0402(1005)_L]  (hidden comment: Resistor 22 +/-1 % 0402 63 mW)
R46  value 10k  [RESC0402(1005)_L]  (hidden comment: Resistor 10K  +/-1 % 0402 63 mW)
R47  value 22  [RESC0402(1005)_L]  (hidden comment: Resistor 22 +/-1 % 0402 63 mW)
R48  value 22  [RESC0402(1005)_L]  (hidden comment: Resistor 22 +/-1 % 0402 63 mW)
R49  value 22  [RESC0402(1005)_L]  (hidden comment: Resistor 22 +/-1 % 0402 63 mW)
U2  BMP388  [PQFN50P200X200X80-10N]
U3  BMP388  [PQFN50P200X200X80-10N]
U4  ICM-42688-P  [PQFN50P300X250X97-14N]
U5  BMI270  [XDCR_BMI270]

### Blocks framed on the sheet
16MB SPI Flash: C18 IC3 R21 R24-R26
SPI Micro-SD Slot: C22 C23 J20 R27-R31
2x8 ESC Connector: J21-J32 R35-R38 R42-R45

### Ports
ESC_TEL_RX (out, see FC_Main[4D]), ESC_TEL_TX (in, see FC_Main[4D]), ESC_TIM1_CH1 (in, see FC_Main[4D]), ESC_TIM1_CH2 (in, see FC_Main[4D]), ESC_TIM1_CH3 (in, see FC_Main[4D]), ESC_TIM1_CH4 (in, see FC_Main[4D]), ESC_TIM8_CH1 (in, see FC_Main[4C]), ESC_TIM8_CH2 (in, see FC_Main[4B]), FLASH_CS (in, see FC_Main[4C]), FLASH_MISO (out, see FC_Main[3C]), FLASH_MOSI (in, see FC_Main[3C]), FLASH_SCK (in, see FC_Main[4C]), I2C1_Baro1_SCL (in, see FC_Main[3B]), I2C1_Baro1_SDA (bidir, see FC_Main[3B]), I2C2_Baro2_SCL (in, see FC_Main[4D]), I2C2_Baro2_SDA (bidir, see FC_Main[4D]), IMU1_CS (in, see FC_Main[3D]), IMU1_INT (out, see FC_Main[3D]), IMU1_MISO (out, see FC_Main[3D]), IMU1_MOSI (in, see FC_Main[3D]), IMU1_SCK (in, see FC_Main[3D]), IMU2_CS (in, see FC_Main[4B]), IMU2_INT (out, see FC_Main[4B]), IMU2_MISO (out, see FC_Main[4B]), IMU2_MOSI (in, see FC_Main[4B]), IMU2_SCK (in, see FC_Main[4B]), SD_CS (in, see FC_Main[3B]), SD_MISO (out, see FC_Main[3B]), SD_MOSI (in, see FC_Main[3B]), SD_SCK (in, see FC_Main[3B]), SD_SENSE (out, see FC_Main[3B])

### Nets
3V3: C18.1 C19.1 C20.1 C21.1 C22.1 C23.1 C26.1 C27.1 C28.1 C29.1 C30.1 C31.1 C32.1 C33.1 C34.1 C35.1 C36.1 IC3.3(/WP_(IO2)) IC3.7(/HOLD_OR_/RESET_(IO3)) IC3.8(VCC) IC4.1(OUT) IC4.2(SNS) J20.4 R21.1 R22.2 R23.2 R27.1 R28.1 R32.2 R33.2 R34.1 R46.1 U2.1(VDDIO) U2.6(CSB) U2.10(VDD) U3.1(VDDIO) U3.6(CSB) U3.10(VDD) U4.5(VDDIO) U4.8(VDD) U5.5(VDDIO) U5.8(VDD)
5V: C24.1 C25.2 D6.4(K1K2) IC4.4(EN) IC4.6(IN)
GND: C18.2 C19.2 C20.2 C21.2 C22.2 C23.2 C24.2 C25.1 C26.2 C27.2 C28.2 C29.2 C30.2 C31.2 C32.2 C33.2 C34.2 C35.2 C36.2 D4.A D5.A IC3.4(GND) IC4.3(GND_1) IC4.5(GND_2) IC4.7(EP) J20.6 J20.MP1 J20.MP2 J20.MP3 J20.MP4 J25.1(Pad_In) J31.1(Pad_In) U2.3(VSS) U2.5(SDO) U2.8(VSS) U2.9(VSS) U3.3(VSS) U3.5(SDO) U3.8(VSS) U3.9(VSS) U4.6(GND) U4.7(RESV_7) U5.6(GNDIO) U5.7(GND)
VBAT: D5.C D6.1(A1) J26.1(Pad_In) J32.1(Pad_In)
VBUS: D4.C D6.3(A2)
AP_SCL: R39.1 U4.13(AP_SCL/AP_SCLK)
AP_SDA: R40.1 U4.14(AP_SDA/AP_SDIO/AP_SDI)
AP_SDO: R41.1 U4.1(AP_SDO/AP_AD0)
Baro1_SCL: R23.1 U2.2(SCK) ; port I2C1_Baro1_SCL
Baro1_SDA: R22.1 U2.4(SDI) ; port I2C1_Baro1_SDA
Baro2_SCL: R33.1 U3.2(SCK) ; port I2C2_Baro2_SCL
Baro2_SDA: R32.1 U3.4(SDI) ; port I2C2_Baro2_SDA
ESC_TEL_RX: R35.2 ; port ESC_TEL_RX
ESC_TEL_TX: R45.2 ; port ESC_TEL_TX
FLASH_CLK: IC3.6(CLK) R24.2
FLASH_CS: IC3.1(/CS) R21.2 ; port FLASH_CS
FLASH_DI: IC3.5(DI_(IO0)) R26.2
FLASH_DO: IC3.2(DO_(IO1)) R25.1
FLASH_MISO: R25.2 ; port FLASH_MISO
FLASH_MOSI: R26.1 ; port FLASH_MOSI
FLASH_SCK: R24.1 ; port FLASH_SCK
IMU1_CS: R34.2 U4.12(AP_CS) ; port IMU1_CS
IMU1_INT: U4.4(INT1/INT) ; port IMU1_INT
IMU1_MISO: R41.2 ; port IMU1_MISO
IMU1_MOSI: R40.2 ; port IMU1_MOSI
IMU1_SCK: R39.2 ; port IMU1_SCK
IMU2_CS: R46.2 U5.12(CSB) ; port IMU2_CS
IMU2_INT: U5.4(INT1) ; port IMU2_INT
IMU2_MISO: R49.2 ; port IMU2_MISO
IMU2_MOSI: R48.2 ; port IMU2_MOSI
IMU2_SCK: R47.2 ; port IMU2_SCK
SC_SENSE: J20.CD1 R28.2 ; port SD_SENSE
SCX: R47.1 U5.13(SCX)
SD_CS: J20.2 R27.2 ; port SD_CS
SD_MISO: R31.2 ; port SD_MISO
SD_MOSI: R29.2 ; port SD_MOSI
SD_SCK: R30.2 ; port SD_SCK
SDO: R49.1 U5.1(SDO)
SDX: R48.1 U5.14(SDX)
T1-1: R36.2 ; port ESC_TIM1_CH1
T1-2: R42.2 ; port ESC_TIM1_CH2
T1-3: R37.2 ; port ESC_TIM1_CH3
T1-4: R43.2 ; port ESC_TIM1_CH4
T8-1: R38.2 ; port ESC_TIM8_CH1
T8-2: R44.2 ; port ESC_TIM8_CH2
TF-IN: J20.3 R29.1
TF-OUT: J20.7 R31.1
TF-SCK: J20.5 R30.1
NetJ21_1: J21.1(Pad_In) R35.1
NetJ22_1: J22.1(Pad_In) R36.1
NetJ23_1: J23.1(Pad_In) R37.1
NetJ24_1: J24.1(Pad_In) R38.1
NetJ27_1: J27.1(Pad_In) R45.1
NetJ28_1: J28.1(Pad_In) R42.1
NetJ29_1: J29.1(Pad_In) R43.1
NetJ30_1: J30.1(Pad_In) R44.1

Not connected (* = marked no-connect by the designer): J20 1* 8; U2 7(INT)*; U3 7(INT)*; U4 2(RESV_2)* 3(RESV_3)* 9(INT2/FSYNC/CLKIN)* 10(RESV_10)* 11(RESV_11)*; U5 2(ASDX)* 3(ASCX)* 9(INT2)* 10(OSCB)* 11(OSDO)*

### Notes on the sheet
- I2C Barometers
- -Both BMP388
- -Seperate PCB Side + I2C CHN
- Power-In Protection
- 5V to 3.3V Converter
- 6-Axis Accelerometer (IMU)
- -Seperate SPI CHN
- Main - ICM-42688-P
- Backup - BMI270
- THIS DOCUMENT AND THE DATA DISCLOSED HEREIN OR
- HEREWITH IS THE PROPERTY OF ALTIUM LIMITED AND MAY
- DWG NO:
- REVISION
- REV:
- DESCRIPTION
- DATE
- APPROVED
- BE FREELY DISTRIBUTED IN WHOLE. NO RIGHTS ARE
- RESERVED OR EXPRESS OR IMPLIED WARANTEE GIVEN.
- ENG:
- APPROVALS
- PROJECT
- DSN:
- CHK:
- REFERENCE DOCUMENTS
- PROJECT REVISION:
- TITLE
- DOCUMENT REVISION:
- DESIGN ITEM:
- BOM:
- FAB DWG:
- PCB DWG:
- ASSY DWG:
- SCALE:
- A3
- SIZE
- CAGE CODE
- FILE NAME
- DWG NO.
- SHEET
- OF
- REV

### Library data of the parts
C18-C20 C23 C24 C27-C29 C31 C32 C34 C35 = CMP-001-00061-3: as C1 on sheet FC_Main; Mounting Technology: SMT; Voltage Rating: 10V; Max Operating Temperature: 85°C; Pins: 2; Case/Package: 0402; Min Operating Temperature: -55°C
C21 C30 C33 C36 = CMP-001-00056-4: as C2 on sheet FC_Main; Mounting Technology: SMT; Max Operating Temperature: 85°C; Case/Package: 0402; Pins: 2; Min Operating Temperature: -55°C; Voltage Rating: 10V
C22 C26 = CMP-001-00081-4: Chip Capacitor, 22µF +/-40%, 16V, 0805, Thickness 1.45 mm; Tolerance: 5%; Voltage Rating: 16V; Mounting Technology: SMT; Pins: 2; Max Operating Temperature: 85°C; Case/Package: 0805; Min Operating Temperature: -55°C
C25 = CMP-001-00075-4: Chip Capacitor, 10µF +/-20%, 10V, 0603, Thickness 1 mm; Tolerance: 10%; Voltage Rating: 10V; Max Operating Temperature: 85°C; Pins: 2; Case/Package: 0603; Mounting Technology: SMT; Min Operating Temperature: -55°C
D4 D5 = CMP-004-00031-1: as D1 on sheet FC_Main; SnapEDA_Link: https://www.snapeda.com/parts/PTVS5V0S1UR/Nexperia/view-part/?ref=snap; Check_prices: https://www.snapeda.com/parts/PTVS5V0S1UR/Nexperia/view-part/?ref=eda; Design Item ID: PTVS5V0S1UR; Availability: In Stock; Value: *; Case/Package: SOD-123 Nexperia USA; Pins: 2; Price: None; Source: PTVS5V0S1UR.SchLib; Component Type: Standard; MP: PTVS5V0S1UR; Purchase-URL: https://pricing.snapeda.com/search/part/PTVS5V0S1UR/?ref=eda
D6 = CMP-004-00032-1: Diode Array 1 Pair Common Cathode Schottky 60 V 1A (DC) Surface Mount TO-261-4, TO-261AA; MF: NXP Semiconductors; SnapEDA_Link: https://www.snapeda.com/parts/BAT160C/NXP+Semiconductors/view-part/?ref=snap; Value: *; Component Type: Standard; Pins: 3; Availability: In Stock; Price: None; Source: BAT160C.SchLib; Check_prices: https://www.snapeda.com/parts/BAT160C/NXP+Semiconductors/view-part/?ref=eda; Design Item ID: BAT160C; Case/Package: TO-261-4 Nexperia USA; MP: BAT160C; Purchase-URL: https://pricing.snapeda.com/search/part/BAT160C/?ref=eda
IC3 = W25Q128JVSIQ: Integrated Circuit; Manufacturer_Name: Winbond; Datasheet Link: https://www.winbond.com/hq/search-resource-file.jsp?partNo=W25Q128JVSIQ&type=datasheet; Height: 2.16mm; Manufacturer_Part_Number: W25Q128JVSIQ; Mouser Part Number: 454-W25Q128JVSIQ; Mouser Price/Stock: https://www.mouser.co.uk/ProductDetail/Winbond/W25Q128JVSIQ?qs=qSfuJ%252Bfl%2Fd6tLXvPR4fl9w%3D%3D; Arrow Part Number: W25Q128JVSIQ; Arrow Price/Stock: https://www.arrow.com/en/products/w25q128jvsiq/winbond-electronics?utm_currency=USD&region=nac
IC4 = TLV76733DRVR: Integrated Circuit; Manufacturer_Name: Texas Instruments; Datasheet Link: http://www.ti.com/lit/gpn/TLV767; Height: 0.8mm; Manufacturer_Part_Number: TLV76733DRVR; Mouser Part Number: 595-TLV76733DRVR; Mouser Price/Stock: https://www.mouser.co.uk/ProductDetail/Texas-Instruments/TLV76733DRVR?qs=9r4v7xj2LnmGIkwTuPlHig%3D%3D; Arrow Part Number: TLV76733DRVR; Arrow Price/Stock: https://www.arrow.com/en/products/tlv76733drvr/texas-instruments?utm_currency=USD&region=europe
J20 = TF-01A: Connector; Manufacturer_Name: Korean Hroparts Elec; Datasheet Link: https://datasheet.lcsc.com/szlcsc/1903221101_Korean-Hroparts-Elec-TF-01A_C91145.pdf; Height: 1.85mm; Manufacturer_Part_Number: TF-01A
J21-J32 = CMP-002-00076-3: 3mm x 2mm Pad to solder
R21 R27 R28 R34 R46 = CMP-009-00149-3: as R3 on sheet FC_Main; Min Operating Temperature: -55°C; Case/Package: 0402; Max Operating Temperature: 155°C; Pins: 2
R22 R23 R32 R33 = CMP-009-00105-2: as R16 on sheet FC_Main; Mounting Technology: SMT; Case/Package: 0402; Tolerance: 1%; Pins: 2
R24 R26 = CMP-009-00168-3: as R12 on sheet FC_Main; Max Operating Temperature: 155°C; Min Operating Temperature: -55°C; Pins: 2; Case/Package: 0402
R25 R29-R31 R35-R45 R47-R49 = CMP-009-00168-3: as R1 on sheet FC_Main; Max Operating Temperature: 155°C; Min Operating Temperature: -55°C; Pins: 2; Case/Package: 0402
U2 U3 = CMP-031-00007-1: P-Sensor SPI I2C 1, 25 Bar SMD; Design Item ID: BMP388; Price: None; Case/Package: None; MP: BMP388; Value: *; Source: BMP388.SchLib; Component Type: Standard; Pins: 10; Availability: Unavailable
U4 = CMP-021-000000-1: Accelerometer, Gyroscope, 6 Axis Sensor Output; Design Item ID: ICM-42688-P; Package: None; Value: *; Pin Count: 14; Source: ICM-42688-P.SchLib; MP: ICM-42688-P; Availability: Unavailable; Component Type: Standard; Price: None
U5 = CMP-031-00008-1: Accelerometer, Gyroscope, 6 Axis Sensor IÂ²C, SPI Output; MF: Bosch Sensortec; Source: BMI270.SchLib; Case/Package: LGA-14 Bosch Sensortec; Pins: 14; Digi-Key_Part_Number: 828-1091-2-ND; Component Type: Standard; Purchase-URL: https://pricing.snapeda.com/search/part/BMI270/?ref=eda; Value: *; Check_prices: https://www.snapeda.com/parts/BMI270/Bosch+Sensortec/view-part/?ref=eda; MP: BMI270; Design Item ID: BMI270; SnapEDA_Link: https://www.snapeda.com/parts/BMI270/Bosch+Sensortec/view-part/?ref=snap

## Nets that join several sheets
3V3: FC_Main (27 pins), FC_Sheet2 (42 pins)
5V: FC_Main (D1.C J3.1), FC_Sheet2 (5 pins)
GND: FC_Main (51 pins), FC_Sheet2 (44 pins)
VBAT: FC_Main (D2.C J4.1 R13.1 R19.1), FC_Sheet2 (D5.C D6.1 J26.1 J32.1)
VBUS: FC_Main (5 pins), FC_Sheet2 (D4.C D6.3)
Baro1_SCL: FC_Main (U1.92), FC_Sheet2 (R23.1 U2.2)
Baro1_SDA: FC_Main (U1.93), FC_Sheet2 (R22.1 U2.4)
Baro2_SCL: FC_Main (U1.46), FC_Sheet2 (R33.1 U3.2)
Baro2_SDA: FC_Main (U1.47), FC_Sheet2 (R32.1 U3.4)
ESC_TEL_RX: FC_Main (U1.37), FC_Sheet2 (R35.2)
ESC_TEL_TX: FC_Main (U1.38), FC_Sheet2 (R45.2)
FLASH_CS: FC_Main (U1.51), FC_Sheet2 (IC3.1 R21.2)
FLASH_MISO: FC_Main (U1.17), FC_Sheet2 (R25.2)
FLASH_MOSI: FC_Main (U1.16), FC_Sheet2 (R26.1)
FLASH_SCK: FC_Main (U1.52), FC_Sheet2 (R24.1)
IMU1_CS: FC_Main (U1.32), FC_Sheet2 (R34.2 U4.12)
IMU1_INT: FC_Main (U1.28), FC_Sheet2 (U4.4)
IMU1_MISO: FC_Main (U1.30), FC_Sheet2 (R41.2)
IMU1_MOSI: FC_Main (U1.31), FC_Sheet2 (R40.2)
IMU1_SCK: FC_Main (U1.29), FC_Sheet2 (R39.2)
IMU2_CS: FC_Main (U1.81), FC_Sheet2 (R46.2 U5.12)
IMU2_INT: FC_Main (U1.77), FC_Sheet2 (U5.4)
IMU2_MISO: FC_Main (U1.79), FC_Sheet2 (R49.2)
IMU2_MOSI: FC_Main (U1.80), FC_Sheet2 (R48.2)
IMU2_SCK: FC_Main (U1.78), FC_Sheet2 (R47.2)
SC_SENSE: FC_Main (U1.3), FC_Sheet2 (J20.CD1 R28.2)
SD_CS: FC_Main (U1.2), FC_Sheet2 (J20.2 R27.2)
SD_MISO: FC_Main (U1.4), FC_Sheet2 (R31.2)
SD_MOSI: FC_Main (U1.5), FC_Sheet2 (R29.2)
SD_SCK: FC_Main (U1.1), FC_Sheet2 (R30.2)
T1-1: FC_Main (U1.39), FC_Sheet2 (R36.2)
T1-2: FC_Main (U1.41), FC_Sheet2 (R42.2)
T1-3: FC_Main (U1.43), FC_Sheet2 (R37.2)
T1-4: FC_Main (U1.44), FC_Sheet2 (R43.2)
T8-1: FC_Main (U1.63), FC_Sheet2 (R38.2)
T8-2: FC_Main (U1.64), FC_Sheet2 (R44.2)